# EAGLE design Temp monitor (EAGLE 8.0.2)
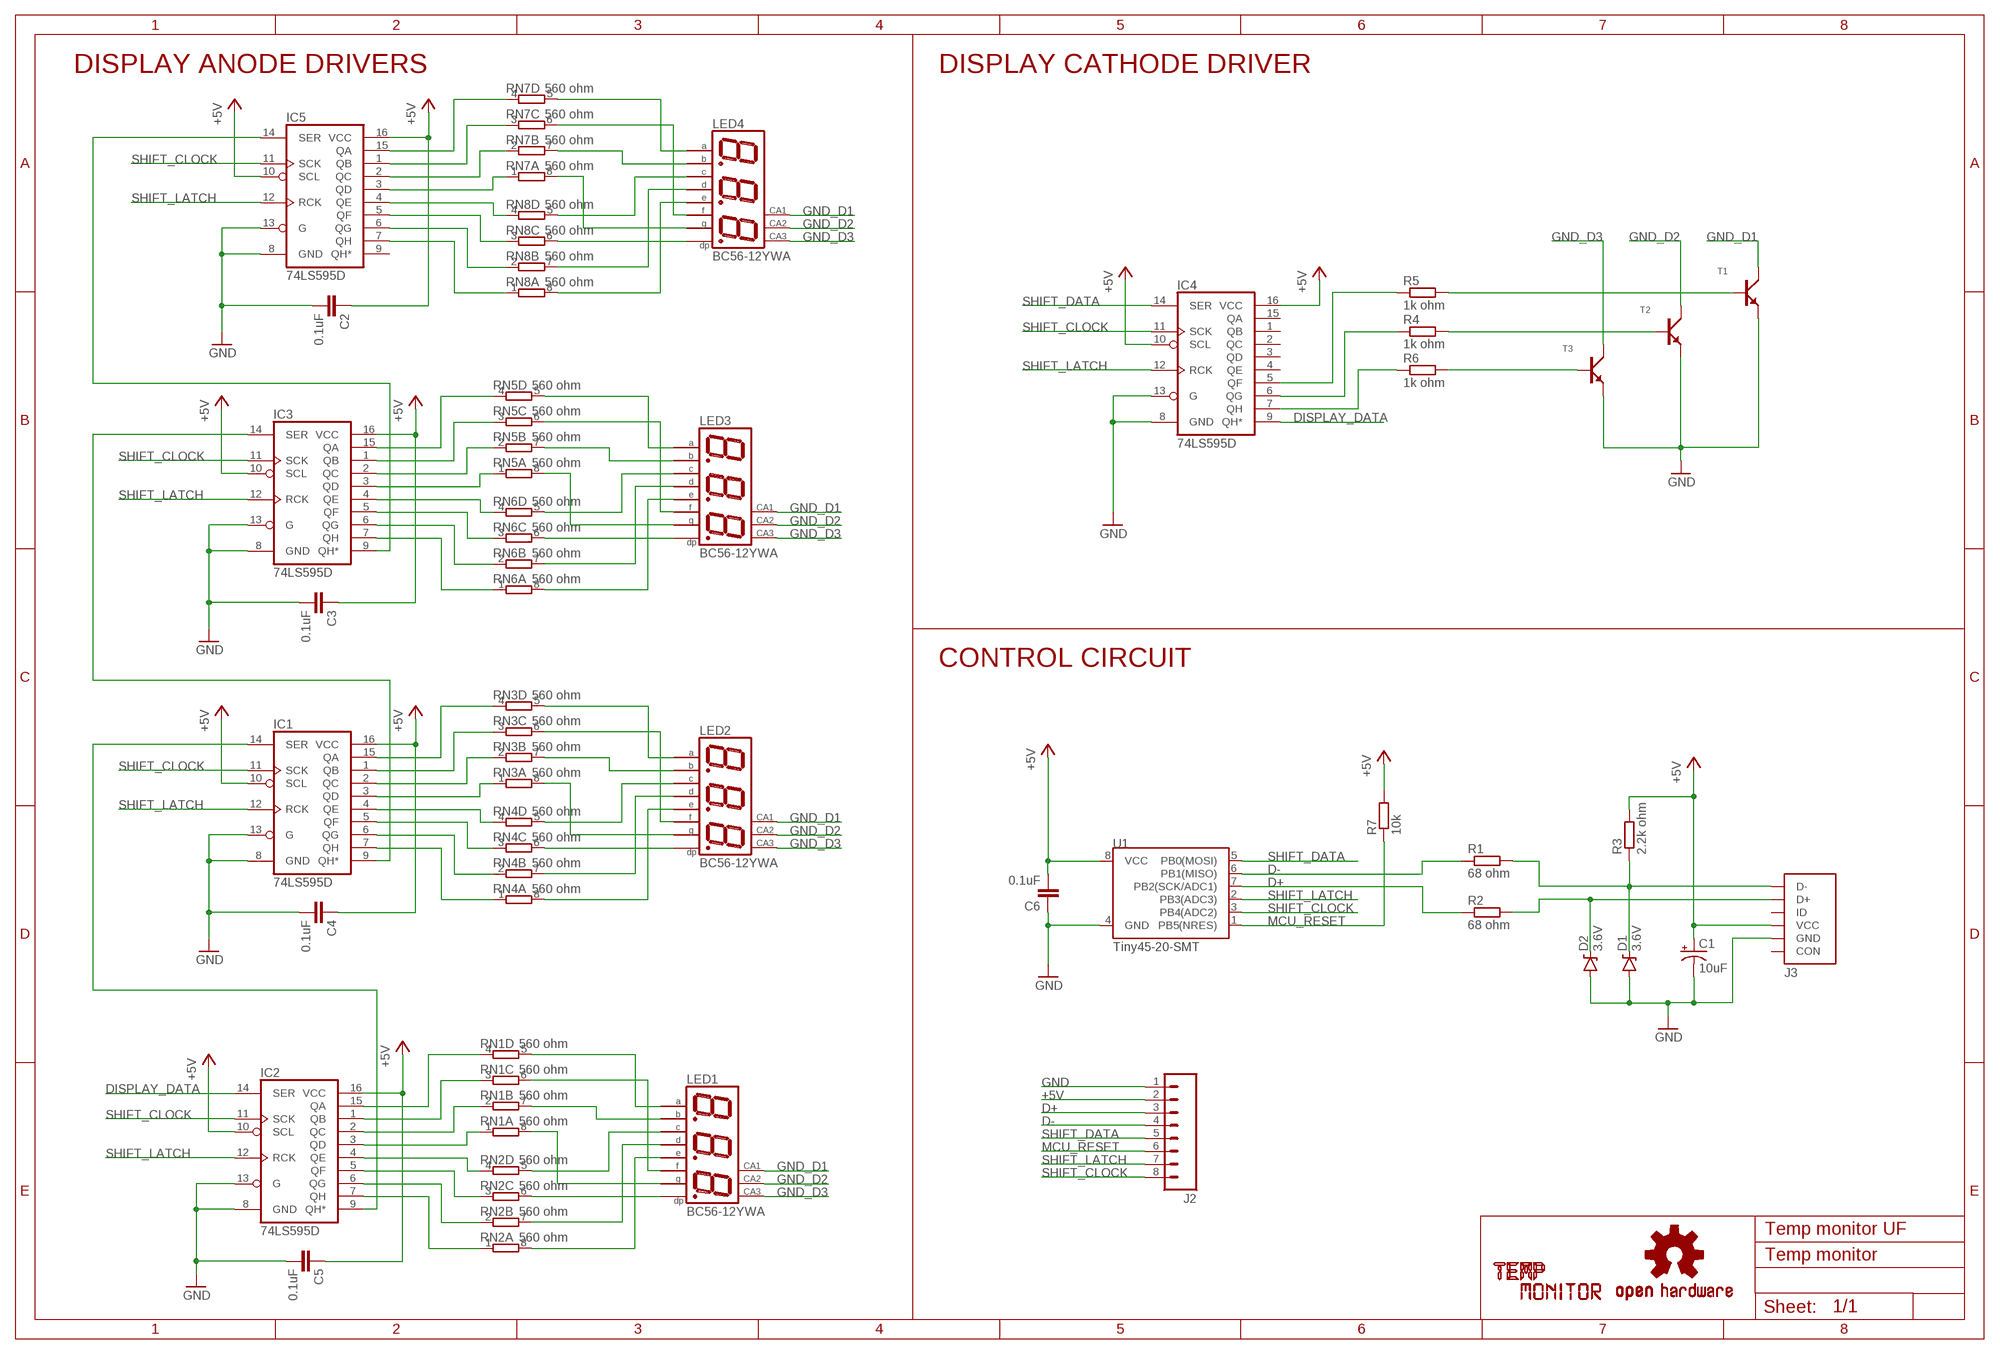
[diagram p0: schematic, sheet 1]

## Parts
C1  10uF  CAP_POLF80  [NIPPON_F80]
C2  0.1uF  C-EUC0805  [C0805]
C3  0.1uF  C-EUC0805  [C0805]
C4  0.1uF  C-EUC0805  [C0805]
C5  0.1uF  C-EUC0805  [C0805]
C6  0.1uF  C-EUC0805  [C0805]
D1  3.6V  DIODE-ZENER16V  [SOD-123]
D2  3.6V  DIODE-ZENER16V  [SOD-123]
IC1  74LS595D  [SO16]
IC2  74LS595D  [SO16]
IC3  74LS595D  [SO16]
IC4  74LS595D  [SO16]
IC5  74LS595D  [SO16]
J2  TP_8  [TP_8]
J3  ZX62D-B-5PA8  [ZX62D-B-5PA8]
LED1  BC56-12YWA  [BX56-12]
LED2  BC56-12YWA  [BX56-12]
LED3  BC56-12YWA  [BX56-12]
LED4  BC56-12YWA  [BX56-12]
LOGO1  OSHW-LOGOL  [OSHW-LOGO-L]
R1  68 ohm  R-EU_R0805W  [R0805W]
R2  68 ohm  R-EU_R0805W  [R0805W]
R3  2.2k ohm  R-EU_R0805W  [R0805W]
R4  1k ohm  R-EU_R0805W  [R0805W]
R5  1k ohm  R-EU_R0805W  [R0805W]
R6  1k ohm  R-EU_R0805W  [R0805W]
R7  10k  R-EU_R0805W  [R0805W]
RN1  560 ohm  4R-NEXBV8V  [EXBV8V]
RN2  560 ohm  4R-NEXBV8V  [EXBV8V]
RN3  560 ohm  4R-NEXBV8V  [EXBV8V]
RN4  560 ohm  4R-NEXBV8V  [EXBV8V]
RN5  560 ohm  4R-NEXBV8V  [EXBV8V]
RN6  560 ohm  4R-NEXBV8V  [EXBV8V]
RN7  560 ohm  4R-NEXBV8V  [EXBV8V]
RN8  560 ohm  4R-NEXBV8V  [EXBV8V]
T1  NPN  [SOT23]
T2  NPN  [SOT23]
T3  NPN  [SOT23]
U1  Tiny45-20-SMT  ATTINY45TINY45-20-SMT  [SO08-EIAJ]
U$1  LOGO  [LOGO_M]
U$2  LOGO  [LOGO_M]

## Nets
+5V: C1.+ C2.1 C3.1 C4.1 C5.1 C6.2 IC1.10(SCL) IC1.16(VCC) IC2.10(SCL) IC2.16(VCC) IC3.10(SCL) IC3.16(VCC) IC4.10(SCL) IC4.16(VCC) IC5.10(SCL) IC5.16(VCC) J2.2 J3.VCC R3.2 R7.2 U1.8(VCC)
D+: J2.3 R2.1 U1.7(PB2(SCK/ADC1))
D-: J2.4 R1.1 U1.6(PB1(MISO))
DISPLAY_DATA: IC2.14(SER) IC4.9(QH*)
GND: C1.- C2.2 C3.2 C4.2 C5.2 C6.1 D1.A D2.A IC1.8(GND) IC1.13(G) IC2.8(GND) IC2.13(G) IC3.8(GND) IC3.13(G) IC4.8(GND) IC4.13(G) IC5.8(GND) IC5.13(G) J2.1 J3.GND T1.2(E) T2.2(E) T3.2(E) U1.4(GND)
GND_D1: LED1.12(CA) LED2.12(CA) LED3.12(CA) LED4.12(CA) T1.3(C)
GND_D2: LED1.9(CA) LED2.9(CA) LED3.9(CA) LED4.9(CA) T2.3(C)
GND_D3: LED1.8(CA) LED2.8(CA) LED3.8(CA) LED4.8(CA) T3.3(C)
MCU_RESET: J2.6 R7.1 U1.1(PB5(NRES))
N$1: D1.C J3.D- R1.2 R3.1
N$2: D2.C J3.D+ R2.2
N$3: IC2.15(QA) RN1.4
N$4: IC2.1(QB) RN1.3
N$5: IC4.7(QH) R6.1
N$7: IC2.2(QC) RN1.2
N$8: IC2.3(QD) RN1.1
N$9: IC2.4(QE) RN2.4
N$10: IC2.5(QF) RN2.3
N$11: IC2.6(QG) RN2.2
N$12: IC2.7(QH) RN2.1
N$13: LED1.4(C) RN2.5
N$14: LED1.7(B) RN1.7
N$15: LED1.11(A) RN1.5
N$16: LED1.10(F) RN1.6
N$17: LED1.5(G) RN1.8
N$18: LED1.2(D) RN2.7
N$19: LED1.3(DP) RN2.6
N$20: LED1.1(E) RN2.8
N$21: IC1.15(QA) RN3.4
N$22: IC1.1(QB) RN3.3
N$23: IC1.2(QC) RN3.2
N$24: IC1.3(QD) RN3.1
N$25: IC1.4(QE) RN4.4
N$26: IC1.5(QF) RN4.3
N$27: IC1.6(QG) RN4.2
N$28: IC1.7(QH) RN4.1
N$29: LED2.1(E) RN4.8
N$30: LED2.2(D) RN4.7
N$31: LED2.4(C) RN4.5
N$32: IC4.6(QG) R4.1
N$33: IC4.5(QF) R5.1
N$34: IC5.15(QA) RN7.4
N$35: R4.2 T2.1(B)
N$36: R5.2 T1.1(B)
N$37: R6.2 T3.1(B)
N$38: LED2.7(B) RN3.7
N$39: LED2.11(A) RN3.5
N$40: LED2.10(F) RN3.6
N$41: LED2.5(G) RN3.8
N$42: LED2.3(DP) RN4.6
N$43: IC3.15(QA) RN5.4
N$44: IC3.1(QB) RN5.3
N$45: IC3.2(QC) RN5.2
N$46: IC3.3(QD) RN5.1
N$47: IC3.4(QE) RN6.4
N$48: IC3.5(QF) RN6.3
N$49: IC3.6(QG) RN6.2
N$50: IC3.7(QH) RN6.1
N$51: LED3.1(E) RN6.8
N$52: LED3.2(D) RN6.7
N$53: LED3.4(C) RN6.5
N$54: LED3.7(B) RN5.7
N$55: LED3.11(A) RN5.5
N$56: LED3.10(F) RN5.6
N$57: LED3.5(G) RN5.8
N$58: LED3.3(DP) RN6.6
N$59: IC5.1(QB) RN7.3
N$60: IC5.2(QC) RN7.2
N$61: IC5.3(QD) RN7.1
N$62: IC5.4(QE) RN8.4
N$63: IC5.5(QF) RN8.3
N$64: IC5.6(QG) RN8.2
N$65: IC5.7(QH) RN8.1
N$66: LED4.1(E) RN8.8
N$67: LED4.2(D) RN8.7
N$68: LED4.4(C) RN8.5
N$69: LED4.7(B) RN7.7
N$70: LED4.11(A) RN7.5
N$71: LED4.10(F) RN7.6
N$72: LED4.5(G) RN7.8
N$73: LED4.3(DP) RN8.6
N$74: IC3.9(QH*) IC5.14(SER)
N$76: IC1.9(QH*) IC3.14(SER)
N$77: IC1.14(SER) IC2.9(QH*)
SHIFT_CLOCK: IC1.11(SCK) IC2.11(SCK) IC3.11(SCK) IC4.11(SCK) IC5.11(SCK) J2.8 U1.3(PB4(ADC2))
SHIFT_DATA: IC4.14(SER) J2.5 U1.5(PB0(MOSI))
SHIFT_LATCH: IC1.12(RCK) IC2.12(RCK) IC3.12(RCK) IC4.12(RCK) IC5.12(RCK) J2.7 U1.2(PB3(ADC3))
Unconnected: IC4.1(QB) IC4.2(QC) IC4.3(QD) IC4.4(QE) IC4.15(QA) IC5.9(QH*) J3.ID J3.P$6(CON) J3.P$7(CON) J3.P$8(CON) J3.P$9(CON) J3.P$10(CON) J3.P$11(CON)

## Notes on the sheet
- DISPLAY ANODE DRIVERS | DISPLAY CATHODE DRIVER
- CONTROL CIRCUIT
- Temp monitor UF

## Library data of the parts
C1 = SparkFun-Capacitors:CAP_POL: Capacitor Polarized These are standard SMD and PTH capacitors. Normally 10uF, 47uF, and 100uF in electrolytic and tantalum varieties. Always verify the external diameter of the through hole cap, it varies with capacity, voltage, and manufacturer. The EIA devices should be standard.
C2-C6 = resistor:C-EU: CAPACITOR, European symbol
D1 D2 = SparkFun-DiscreteSemi:DIODE-ZENER: Zener Diode Production Part - 8199 3.4V Zener Voltage; PROD_ID: DIO-12440; VALUE: 16V
IC1-IC5 = SparkFun-DigitalIC:74*595: 8-bit SHIFT REGISTER, output latch; PROD_ID: IC-07875
J2 = TempMonitor:TP_8
J3 = usb:ZX62D-B-5PA8
LED1-LED4 = display-kingbright:B?56-12*WA: 14.22mm (0.56INCH) THREE DIGIT NUMERIC DISPLAY Source: http://www.kingbright.com .. BA56-11EWA(Ver1189474895.pdf; OC_FARNELL: unknown; OC_NEWARK: unknown
LOGO1 = SparkFun-Aesthetics:OSHW-LOGO: Open Source Hardware Logo This logo indicates the piece of hardware it is found on incorporates a OSHW license and/or adheres to the definition of open source hardware found here: http://freedomdefined.org/OSHW
R1-R7 = resistor:R-EU_: RESISTOR, European symbol
RN1-RN8 = resistor-dil:4R-N: Array Chip Resistor Source: RS Component / Phycomp; OC_FARNELL: unknown; OC_NEWARK: unknown
T1-T3 = TempMonitor:NPN
U1 = SparkFun-DigitalIC:ATTINY45: Atmel 8-pin 2/4/8kB flash uC; PROD_ID: IC-08922
U$1 U$2 = TempMonitor:LOGO

## Board
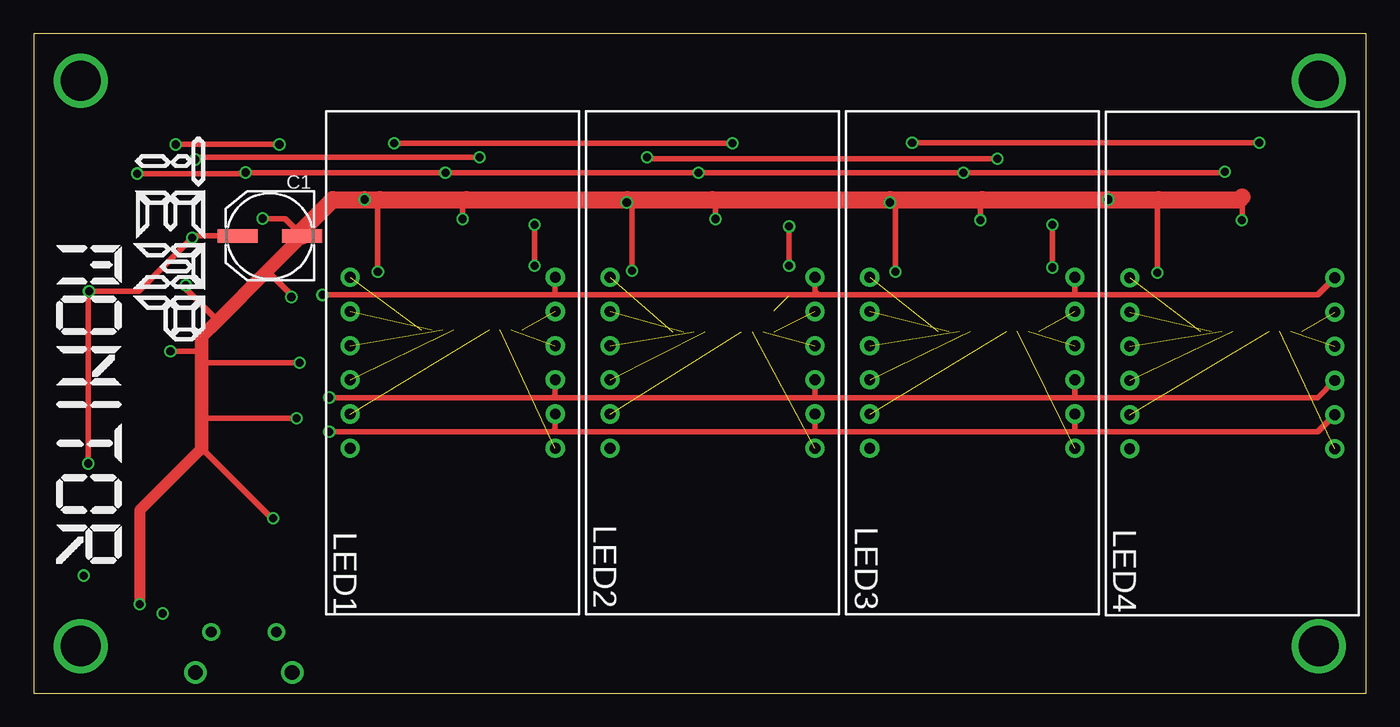
[diagram p1: board, top side]
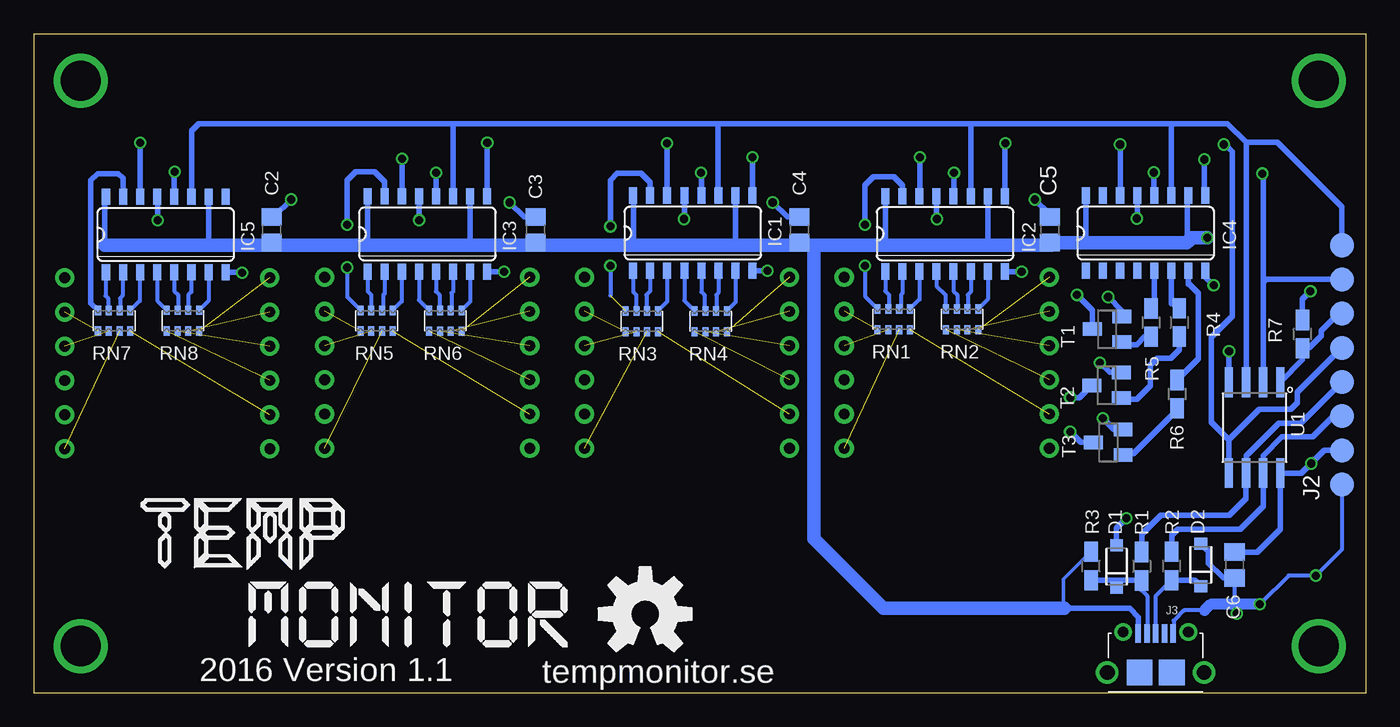
[diagram p2: board, bottom side, seen from below]

Size 99 x 49 mm. Coordinates in mm from the lower left corner, seen from the top.
Outline: 0,0 99,0 99,49 0,49 0,0
Copper layers (1*16): Top 0.035mm / dielectric 1.5mm / Bottom 0.035mm
Design rules "SeeedStudio_2layer_DRU_no_angle_20140221": minimum track width 6mil, minimum drill 12mil, track to track 6mil, track to pad 6mil, pad to pad 6mil, via to via 6mil, smd to smd 0mil, copper to edge 10mil, drill to drill 10mil, minimum pad ring 10mil, minimum via ring 6mil, stop-mask expansion 2mil, vias tented up to drill 100mil, thermal gap 10mil

### Footprints (pad centres in the part's own frame; a part is rotated, then mirrored left to right if it is on the bottom)
NIPPON_F80 = smd 2.95 x 1: + 2.4,0; - -2.4,0
C0805 = smd 1.3 x 1.5: 1 -0.95,0; 2 0.95,0
SOD-123 = smd 0.9 x 0.95: A 1.575,0; C -1.575,0
SO16 = smd 0.6 x 1.2: 1 -4.445,-2.8; 2 -3.175,-2.8; 3 -1.905,-2.8; 4 -0.635,-2.8; 5 0.635,-2.8; 6 1.905,-2.8; 7 3.175,-2.8; 8 4.445,-2.8; 9 4.445,2.8; 10 3.175,2.8; 11 1.905,2.8; 12 0.635,2.8; 13 -0.635,2.8; 14 -1.905,2.8; 15 -3.175,2.8; 16 -4.445,2.8
TP_8 = smd 1.778 x 1.778: 1 0,0; 2 2.54,0; 3 5.08,0; 4 7.62,0; 5 10.16,0; 6 12.7,0; 7 15.24,0; 8 17.78,0
ZX62D-B-5PA8 = smd 0.4 x 1.35: D+ 0,0; D- -0.65,0; GND 1.3,0; ID 0.65,0; VCC -1.3,0 | drill 0.8: P$6 2.425,0.1; P$7 -2.425,0.1 | drill 1.1: P$8 -3.6,-2.9; P$9 3.6,-2.9 | smd 1.9 x 1.9: P$10 1.2,-2.9; P$11 -1.2,-2.9
BX56-12 = drill 0.8 pad 1.422: 1 -6.35,-7.62; 2 -3.81,-7.62; 3 -1.27,-7.62; 4 1.27,-7.62; 5 3.81,-7.62; 6 6.35,-7.62; 7 6.35,7.62; 8 3.81,7.62; 9 1.27,7.62; 10 -1.27,7.62; 11 -3.81,7.62; 12 -6.35,7.62
R0805W = smd 1.5 x 1: 1 -1.052,0; 2 1.052,0
EXBV8V = smd 0.45 x 0.7: 1 -1.2,-0.775; 2 -0.4,-0.775; 3 0.4,-0.775; 4 1.2,-0.775; 5 1.2,0.775; 6 0.4,0.775; 7 -0.4,0.775; 8 -1.2,0.775
SOT23 = smd 1 x 1.4: 1 -0.95,-1.1; 2 0.95,-1.1; 3 0,1.1
SO08-EIAJ = smd 0.61 x 2.21: 1 -1.905,-3.378; 2 -0.635,-3.378; 3 0.635,-3.378; 4 1.905,-3.378; 5 1.905,3.353; 6 0.635,3.353; 7 -0.635,3.353; 8 -1.905,3.353

### Placement (x,y rotation side)
C1  17.56,33.98 180 top
C2  81.31,34.43 90 bottom
C3  61.71,34.43 90 bottom
C4  42.1,34.43 90 bottom
C5  23.48,34.43 90 bottom
C6  9.76,9.53 90 bottom
D1  18.53,9.41 90 bottom
D2  12.27,9.54 90 bottom
IC1  50.01,34.18 0 bottom
IC2  31.27,34.13 0 bottom
IC3  69.73,34.12 0 bottom
IC4  16.36,34.18 0 bottom
IC5  89.18,34.08 0 bottom
J2  1.79,15.5 90 bottom
J3  15.62,4.45 0 bottom
LED1  31.14,24.55 270 top
LED2  50.45,24.55 270 top
LED3  69.75,24.55 270 top
LED4  89.07,24.51 270 top
LOGO1  53.55,5.88 0 bottom
R1  16.66,9.44 270 bottom
R2  14.45,9.46 270 bottom
R3  20.43,9.46 90 bottom
R4  13.86,27.55 270 bottom
R5  15.97,27.53 270 bottom
R6  14.04,22.22 270 bottom
R7  4.71,26.68 90 bottom
RN1  35.08,27.78 180 bottom
RN2  30,27.78 180 bottom
RN3  53.81,27.63 180 bottom
RN4  48.69,27.63 180 bottom
RN5  73.51,27.67 180 bottom
RN6  68.41,27.67 180 bottom
RN7  93.02,27.67 180 bottom
RN8  87.91,27.68 180 bottom
T1  19.22,27.05 90 bottom
T2  19.27,22.88 90 bottom
T3  19.14,18.64 90 bottom
U1  8.27,19.72 180 bottom
U$1  1.68,41.31 270 top
U$2  91.04,3.44 0 bottom

### Tracks (layer width: path | path; a pad name or v marks a point on that pad's centre or on a via)
+5V  (via drill 0.6)
  Top 0.406: C1.+ 11.94,33.98 v11.79,33.83 7.82,29.87 v4.12,29.87 4.06,29.82 v4.06,17.07
  Bottom 0.254: R3.2 22.48,8.46 22.48,6.3
  Bottom 0.406: 74.14,36.92 IC3.16 74.18,33.28 | 35.78,36.93 IC2.16 35.71,33.43 35.57,33.28 | IC1.16 54.42,36.98 54.42,33.34 54.36,33.28 | IC3.10 66.56,33.54 66.3,33.28 | 28.16,36.93 IC2.10 28.09,33.39 28.2,33.28 | 93.73,33.28 93.73,36.77 IC5.16 | IC5.10 86,33.68 85.61,33.28 | IC1.10 46.84,33.44 47,33.28 | C2.1 81.54,33.48 81.54,33.28 | C3.1 61.98,33.48 61.98,33.28 | C4.1 41.92,33.48 41.92,33.28 | C5.1 23.38,33.48 23.38,33.28 | C6.2 8.06,10.48 6.35,12.19 6.35,16.35 | 6.35,16.35 U1.8 | J3.VCC 16.92,5.66 17.55,6.3 22.4,6.3 | 13.28,33.5 13.28,36.88 IC4.10 | IC4.16 20.8,33.6 20.93,33.48 | R7.2 4.71,29.28 v4.12,29.87 | J2.2 3.09,18.04 v4.06,17.07 4.78,16.35 6.35,16.35
  Bottom 1.016: 23.38,33.28 28.2,33.28 35.57,33.28 41.02,33.28 | 41.02,33.28 41.92,33.28 47,33.28 54.36,33.28 61.98,33.28 66.3,33.28 74.18,33.28 81.54,33.28 85.61,33.28 93.73,33.28 | 22.4,6.3 22.48,6.3 35.84,6.3 41.02,11.48 41.02,33.28 | 23.38,33.48 20.93,33.48 13.31,33.48 13.28,33.5 12.95,33.83 v11.79,33.83
D+
  Bottom 0.406: R2.1 14.44,10.52 | J2.3 2.42,20.58 3.94,19.06 6.23,19.06 7.63,17.66 7.63,16.38 U1.7 7.64,13.89 9.34,12.19 13.97,12.19 14.41,11.75 14.41,10.54 R2.1 | 14.44,10.52 R2.1
D-
  Bottom 0.406: R1.1 16.86,10.69 | J2.4 4.83,20.07 6.49,20.07 8.9,17.66 8.9,16.38 U1.6 8.91,14.43 8.94,14.43 10.16,13.21 15.24,13.21 16.64,11.81 16.64,10.51 R1.1 | 16.62,10.53 R1.1
DISPLAY_DATA  (via drill 0.6)
  Top 0.406: v33.14,39.83 12.01,39.83 v12.01,39.65
  Bottom 0.406: v33.14,39.83 33.14,36.93 IC2.14 | IC4.9 12.01,36.98 v12.01,39.65 12.01,39.85
GND  (via drill 0.6)
  Top 0.406: v17.79,13.01 17.69,13.01 12.49,18.21 | IC5.13 89.81,35.15 v89.79,35.13 | v70.36,35.15 70.36,36.55 70.48,36.68 | v83.52,31.24 83.52,36.6 83.59,36.68 | v64.03,31.32 64.03,36.06 | 64.03,36.06 v63.63,36.46 | v50.67,35.23 50.67,36.45 50.44,36.68 | 44.12,36.68 44.08,36.63 v44.08,36.46 44.48,36.06 v44.48,31.39 | v31.88,35.23 31.88,36.4 32.16,36.68 | v25.58,31.32 25.58,36.52 25.73,36.68 | 64.03,36.06 64.03,36.3 63.65,36.68 | v10.17,25.41 12.13,25.41 12.49,25.04 | v11.31,30.31 11.31,30.04 13.66,27.69 | v17.03,35.27 18.68,35.27 C1.- | v19.15,29.44 19.15,29.59 17.36,31.38 | v19.76,24.56 12.62,24.56 12.49,24.69 | v19.53,20.42 12.52,20.42 12.49,20.4
  Top 0.813: 12.49,18.21 7.88,13.6 7.88,6.68 7.87,6.67 v7.87,6.6
  Top 1.016: 12.49,18.21 12.49,20.4 12.49,24.69 12.49,25.04 12.49,26.51 13.66,27.69 17.36,31.38 C1.-
  Top 1.27: C1.- 19.96,34.41 22.23,36.68 v24.59,36.68 25.73,36.68 32.16,36.68 44.12,36.68 50.44,36.68 63.65,36.68 70.48,36.68 v79.86,36.68 83.59,36.68 89.62,36.68 IC5.13
  Bottom 0.305: 12,6.16 13.53,6.16 14.29,5.4 14.29,4.48 J3.GND | C6.1 9.76,6.75 9.91,6.6 9.6,6.29 v9.6,5.93 | v7.87,6.6 5.73,8.75 v3.72,8.75 1.79,10.68 J2.1
  Bottom 0.406: 65.29,31.25 IC3.8 v64.03,31.32 | IC4.13 16.99,35.43 v17.03,35.27 | IC4.8 11.91,30.92 v11.31,30.31 | U1.4 v10.18,25.4 v10.17,25.41 | C3.2 62.56,35.38 v63.63,36.46 | C4.2 43,35.38 v44.08,36.46 | D2.A 11.7,10.53 11.7,9.66 10.6,8.57 C6.1 | D1.A 18.53,12.27 v17.79,13.01 | v89.79,35.13 89.79,36.85 IC5.13 | C2.2 81.16,35.38 v79.86,36.68 | IC3.13 70.37,35.16 v70.36,35.15 | IC5.8 83.55,31.28 v83.52,31.24 | IC1.13 50.65,35.26 v50.67,35.23 | IC2.13 31.9,35.26 v31.88,35.23 | IC2.8 v25.59,31.33 v25.58,31.32 | C5.2 23.48,35.57 v24.59,36.68 | T1.2 18.12,28.41 v19.15,29.44 | T2.2 19.03,23.83 v19.76,24.56 | T3.2 18.7,19.59 v19.53,20.42 | IC1.8 v44.49,31.38 v44.48,31.39
  Bottom 0.813: v7.87,6.6 9.91,6.6 11.56,6.6 12,6.16
GND_D1  (via drill 0.6)
  Top 0.406: v21.46,29.59 38.73,29.59 | 38.73,29.59 58.29,29.59 | 58.29,29.59 77.34,29.59 | 77.34,29.59 95.42,29.59 LED4.12 | LED3.12 77.37,29.62 77.34,29.59 | LED2.12 58.07,29.82 58.29,29.59 | LED1.12 38.76,29.62 38.73,29.59
  Bottom 0.406: v21.46,29.59 20.32,28.45 T1.3
GND_D2  (via drill 0.6)
  Top 0.406: v21.97,21.97 38.61,21.97 | 38.61,21.97 58.04,21.97 | 58.04,21.97 77.47,21.97 | 77.47,21.97 95.42,21.97 LED4.9 | LED3.9 77.37,22.07 77.47,21.97 | LED2.9 58.07,22 58.04,21.97 | LED1.9 38.76,22.12 38.61,21.97
  Bottom 0.406: T2.3 21.28,21.97 v21.97,21.97
GND_D3  (via drill 0.6)
  Top 0.406: v21.97,19.43 38.61,19.43 | 38.61,19.43 58.04,19.43 | 58.04,19.43 77.47,19.43 | 77.47,19.43 95.42,19.43 LED4.8 | LED3.8 77.37,19.53 77.47,19.43 | LED2.8 58.07,19.46 58.04,19.43 | LED1.8 38.76,19.59 38.61,19.43
  Bottom 0.406: v21.97,19.43 21.18,18.64 T3.3
MCU_RESET
  Bottom 0.406: U1.1 4.71,24.76 R7.1 4.67,25.66 4.2,25.66 3.31,26.55 3.31,26.93 2.04,28.2 J2.6
N$1
  Bottom 0.305: R1.2 16.66,7.64 16.26,7.24 16.26,4.46 J3.D-
  Bottom 0.406: 16.79,8.26 R1.2 | 16.65,8.37 R1.2 | 18.54,8.38 R1.2 | 18.54,8.38 20.41,8.38 R3.1 | D1.C 18.53,8.37 18.54,8.38
N$2
  Bottom 0.305: J3.D+ 15.62,7.23 R2.2
  Bottom 0.406: 14.49,8.36 R2.2 | 14.23,8.19 R2.2 | R2.2 12.72,8.41 D2.C
N$3  (via drill 0.6)
  Top 0.406: v37.22,34.81 v37.22,31.76
  Bottom 0.305: v37.22,31.76 37.22,29.5 RN1.4
  Bottom 0.406: IC2.15 34.44,37.75 35.06,38.36 36.58,38.36 37.22,37.73 v37.22,34.81
N$4
  Bottom 0.305: IC2.1 35.71,29.87 35.43,29.59 35.43,28.6 RN1.3
N$5
  Bottom 0.406: IC4.7 13.18,30.4 13.13,30.4 12.45,29.72 12.45,24.86 R6.1
N$7
  Bottom 0.305: IC2.2 34.44,29.69 34.54,29.59 34.54,28.69 RN1.2
N$8
  Bottom 0.305: IC2.3 33.17,29.26 RN1.1
N$9
  Bottom 0.305: IC2.4 31.9,30.25 31.24,29.59 31.24,28.6 RN2.4
N$10
  Bottom 0.305: IC2.5 30.63,29.87 30.35,29.59 30.35,28.6 RN2.3
N$11
  Bottom 0.305: IC2.6 29.36,29.82 29.59,29.59 RN2.2
N$12
  Bottom 0.305: IC2.7 28.09,29.26 RN2.1
N$13  (1 unrouted)
N$14  (1 unrouted)
N$15  (1 unrouted)
N$16  (1 unrouted)
N$17  (1 unrouted)
N$18  (1 unrouted)
N$19  (1 unrouted)
N$20  (1 unrouted)
N$21  (via drill 0.6)  (1 unrouted)
  Top 0.406: v56.14,34.68 v56.14,31.76
  Bottom 0.305: v56.14,31.76 56.14,29.54
  Bottom 0.406: IC1.15 53.19,37.95 53.86,38.62 55.63,38.62 56.14,38.11 v56.14,34.68
N$22
  Bottom 0.305: IC1.1 54.46,29.82 54.23,29.59 54.23,28.42 RN3.3
N$23
  Bottom 0.305: IC1.2 53.19,29.87 53.47,29.59 53.47,28.46 RN3.2
N$24
  Bottom 0.305: IC1.3 51.92,29.09 RN3.1
N$25
  Bottom 0.305: IC1.4 50.65,29.16 RN4.4
N$26
  Bottom 0.305: IC1.5 49.38,29.82 49.15,29.59 49.15,28.46 RN4.3
N$27
  Bottom 0.305: IC1.6 48.11,29.74 48.26,29.59 48.26,28.43 RN4.2
N$28
  Bottom 0.305: IC1.7 46.84,29.05 RN4.1
N$29  (1 unrouted)
N$30  (1 unrouted)
N$31  (1 unrouted)
N$32
  Bottom 0.406: IC4.6 14.45,28.94 R4.1
N$33
  Bottom 0.406: IC4.5 15.72,28.57 R5.1
N$34
  Bottom 0.406: IC5.15 92.36,38.25 92.71,38.61 94.23,38.61 94.74,38.1 94.74,28.97 RN7.4
N$35
  Bottom 0.406: R4.2 13.86,25.51 14.48,24.89 15.49,24.89 16,24.38 16,22.86 17.02,21.84 18.09,21.84 T2.1
N$36
  Bottom 0.406: R5.2 16.45,26.47 17.02,25.91 18.05,25.91 T1.1
N$37
  Bottom 0.406: R6.2 14.04,21.01 17.27,17.78 17.95,17.78 T3.1
N$38  (1 unrouted)
N$39  (1 unrouted)
N$40  (1 unrouted)
N$41  (1 unrouted)
N$42  (1 unrouted)
N$43  (via drill 0.6)
  Top 0.406: v75.7,34.81 v75.7,31.63
  Bottom 0.305: v75.7,31.63 75.7,29.44 RN5.4
  Bottom 0.406: IC3.15 72.91,37.98 73.67,38.74 75.06,38.74 75.7,38.11 v75.7,34.81
N$44
  Bottom 0.305: IC3.1 74.18,29.86 73.91,29.59 RN5.3
N$45
  Bottom 0.305: IC3.2 72.91,29.71 73.03,29.59 73.03,28.53 RN5.2
N$46
  Bottom 0.305: IC3.3 71.64,29.12 RN5.1
N$47
  Bottom 0.305: IC3.4 70.37,29.2 RN6.4
N$48
  Bottom 0.305: IC3.5 69.1,29.86 68.83,29.59 68.83,28.46 RN6.3
N$49
  Bottom 0.305: IC3.6 67.83,29.83 67.94,29.72 67.94,28.51 RN6.2
N$50
  Bottom 0.305: IC3.7 66.56,29.09 RN6.1
N$51  (1 unrouted)
N$52  (1 unrouted)
N$53  (1 unrouted)
N$54  (1 unrouted)
N$55  (1 unrouted)
N$56  (1 unrouted)
N$57  (1 unrouted)
N$58  (1 unrouted)
N$59
  Bottom 0.305: 93.66,31.28 93.66,29.52 93.47,29.34 93.47,28.5 RN7.3
  Bottom 0.406: IC5.1 93.66,31.28
N$60
  Bottom 0.305: 92.39,31.28 92.39,29.54 92.58,29.34 92.58,28.48 RN7.2
  Bottom 0.406: IC5.2 92.39,31.28
N$61
  Bottom 0.305: 91.11,31.28 91.11,29.15 RN7.1
  Bottom 0.406: IC5.3 91.11,31.28
N$62
  Bottom 0.305: IC5.4 89.81,29.16 RN8.4
N$63
  Bottom 0.305: IC5.5 88.55,29.87 88.27,29.59 88.27,28.5 RN8.3
N$64
  Bottom 0.305: IC5.6 87.28,29.82 87.5,29.59 RN8.2
N$65
  Bottom 0.305: IC5.7 86,29.16 RN8.1
N$66  (1 unrouted)
N$67  (1 unrouted)
N$68  (1 unrouted)
N$69  (1 unrouted)
N$70  (1 unrouted)
N$71  (1 unrouted)
N$72  (1 unrouted)
N$73  (1 unrouted)
N$74  (via drill 0.6)
  Top 0.406: v91.08,40.9 v65.29,40.9
  Bottom 0.406: IC5.14 v91.08,40.9 | v65.29,40.9 IC3.9
N$76  (via drill 0.6)
  Top 0.406: v45.59,39.83 45.59,39.7 v71.62,39.7
  Bottom 0.406: IC1.9 45.57,39.83 v45.59,39.83 | v71.62,39.7 71.62,36.92 IC3.14
N$77  (via drill 0.6)
  Top 0.406: v26.79,40.85 v51.94,40.85
  Bottom 0.406: IC2.9 26.82,40.85 v26.79,40.85 | v51.94,40.85 51.94,36.98 IC1.14
N$78  (via drill 3)
  other vias: 3.5,45.5
N$79  (via drill 3)
  other vias: 95.5,45.5
N$80  (via drill 3)
  other vias: 95.5,3.5
N$81  (via drill 3)
  other vias: 3.5,3.5
SHIFT_CLOCK
  Bottom 0.406: 67.83,42.3 48.14,42.3 | 48.14,42.3 29.34,42.3 | IC2.11 arc-90 29.34,36.95 29.34,42.3 | IC1.11 arc90 48.14,37.02 48.14,42.3 | IC3.11 arc-90 IC3.11 67.83,42.3 | U1.3 8.9,23.1 8.9,27.57 8.89,27.57 8.89,40.92 | 1.41,33.03 1.66,33.28 J2.8 1.79,36.13 6.58,40.92 8.89,40.92 | 67.83,42.3 86.75,42.3 87.26,41.79 87.26,36.89 IC5.11 | 29.34,42.3 14.45,42.3 | 14.45,42.3 IC4.11 | 14.45,42.3 14.44,42.32 10.29,42.32 8.89,40.92
SHIFT_DATA  (via drill 0.6)
  Top 0.406: v10.57,40.77 v18.26,40.77
  Bottom 0.406: 18.29,37.11 IC4.14 v18.26,40.77 | U1.5 10.18,18.84 | 10.18,18.84 11.47,20.13 11.47,26.43 9.91,27.99 9.91,40.23 10.44,40.77 v10.57,40.77 | J2.5 5.09,22.36 5.09,21.6 5.6,21.09 7.92,21.09 10.18,18.84
SHIFT_LATCH  (via drill 0.6)
  Top 0.406: v88.53,38.74 88.53,38.68 v69.08,38.68 v49.4,38.68 v30.6,38.68 v15.75,38.68 15.67,38.61 v7.7,38.61
  Bottom 0.406: v30.6,38.68 30.6,36.93 IC2.12 | IC1.12 49.38,38.68 v49.4,38.68 | IC3.12 69.1,38.68 v69.08,38.68 | IC5.12 88.55,38.74 v88.53,38.74 | IC4.12 15.75,36.98 v15.75,38.68 | U1.2 7.64,30.5 | 7.64,30.5 7.64,38.55 v7.7,38.61 | J2.7 7.4,30.74 7.64,30.5

### Text on the board
bPlace: tempmonitor.se | 2016 Version 1.1